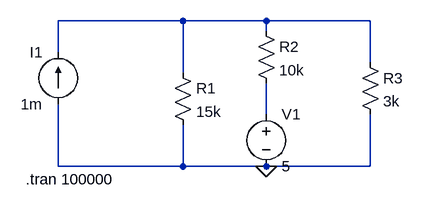
[diagram p0: schematic Assignment2_sim1.asc]
Assignment2_sim1.asc, the LTspice schematic file:
Version 4
SHEET 1 880 680
WIRE 208 64 16 64
WIRE 336 64 208 64
WIRE 496 64 336 64
WIRE 336 80 336 64
WIRE 16 112 16 64
WIRE 496 128 496 64
WIRE 208 144 208 64
WIRE 336 208 336 160
WIRE 16 288 16 192
WIRE 208 288 208 224
WIRE 208 288 16 288
WIRE 336 288 208 288
WIRE 496 288 496 208
WIRE 496 288 336 288
FLAG 336 288 0
SYMBOL res 192 128 R0
SYMATTR InstName R1
SYMATTR Value 15k
SYMBOL res 320 64 R0
SYMATTR InstName R2
SYMATTR Value 10k
SYMBOL current 16 192 R180
WINDOW 0 24 80 Left 2
WINDOW 3 24 0 Left 2
WINDOW 123 0 0 Left 0
WINDOW 39 0 0 Left 0
SYMATTR InstName I1
SYMATTR Value 1m
SYMBOL voltage 336 192 R0
WINDOW 123 0 0 Left 0
WINDOW 39 0 0 Left 0
SYMATTR InstName V1
SYMATTR Value 5
SYMBOL res 480 112 R0
SYMATTR InstName R3
SYMATTR Value 3k
TEXT -34 308 Left 2 !.tran 100000

The netlist it stands for:
* Assignment2_sim1.asc
R1 N001 0 15k
R2 N001 N002 10k
I1 0 N001 1m
V1 N002 0 5
R3 N001 0 3k
.tran 100000
.backanno
.end